# EAGLE design teensyv (EAGLE 9.6.1)
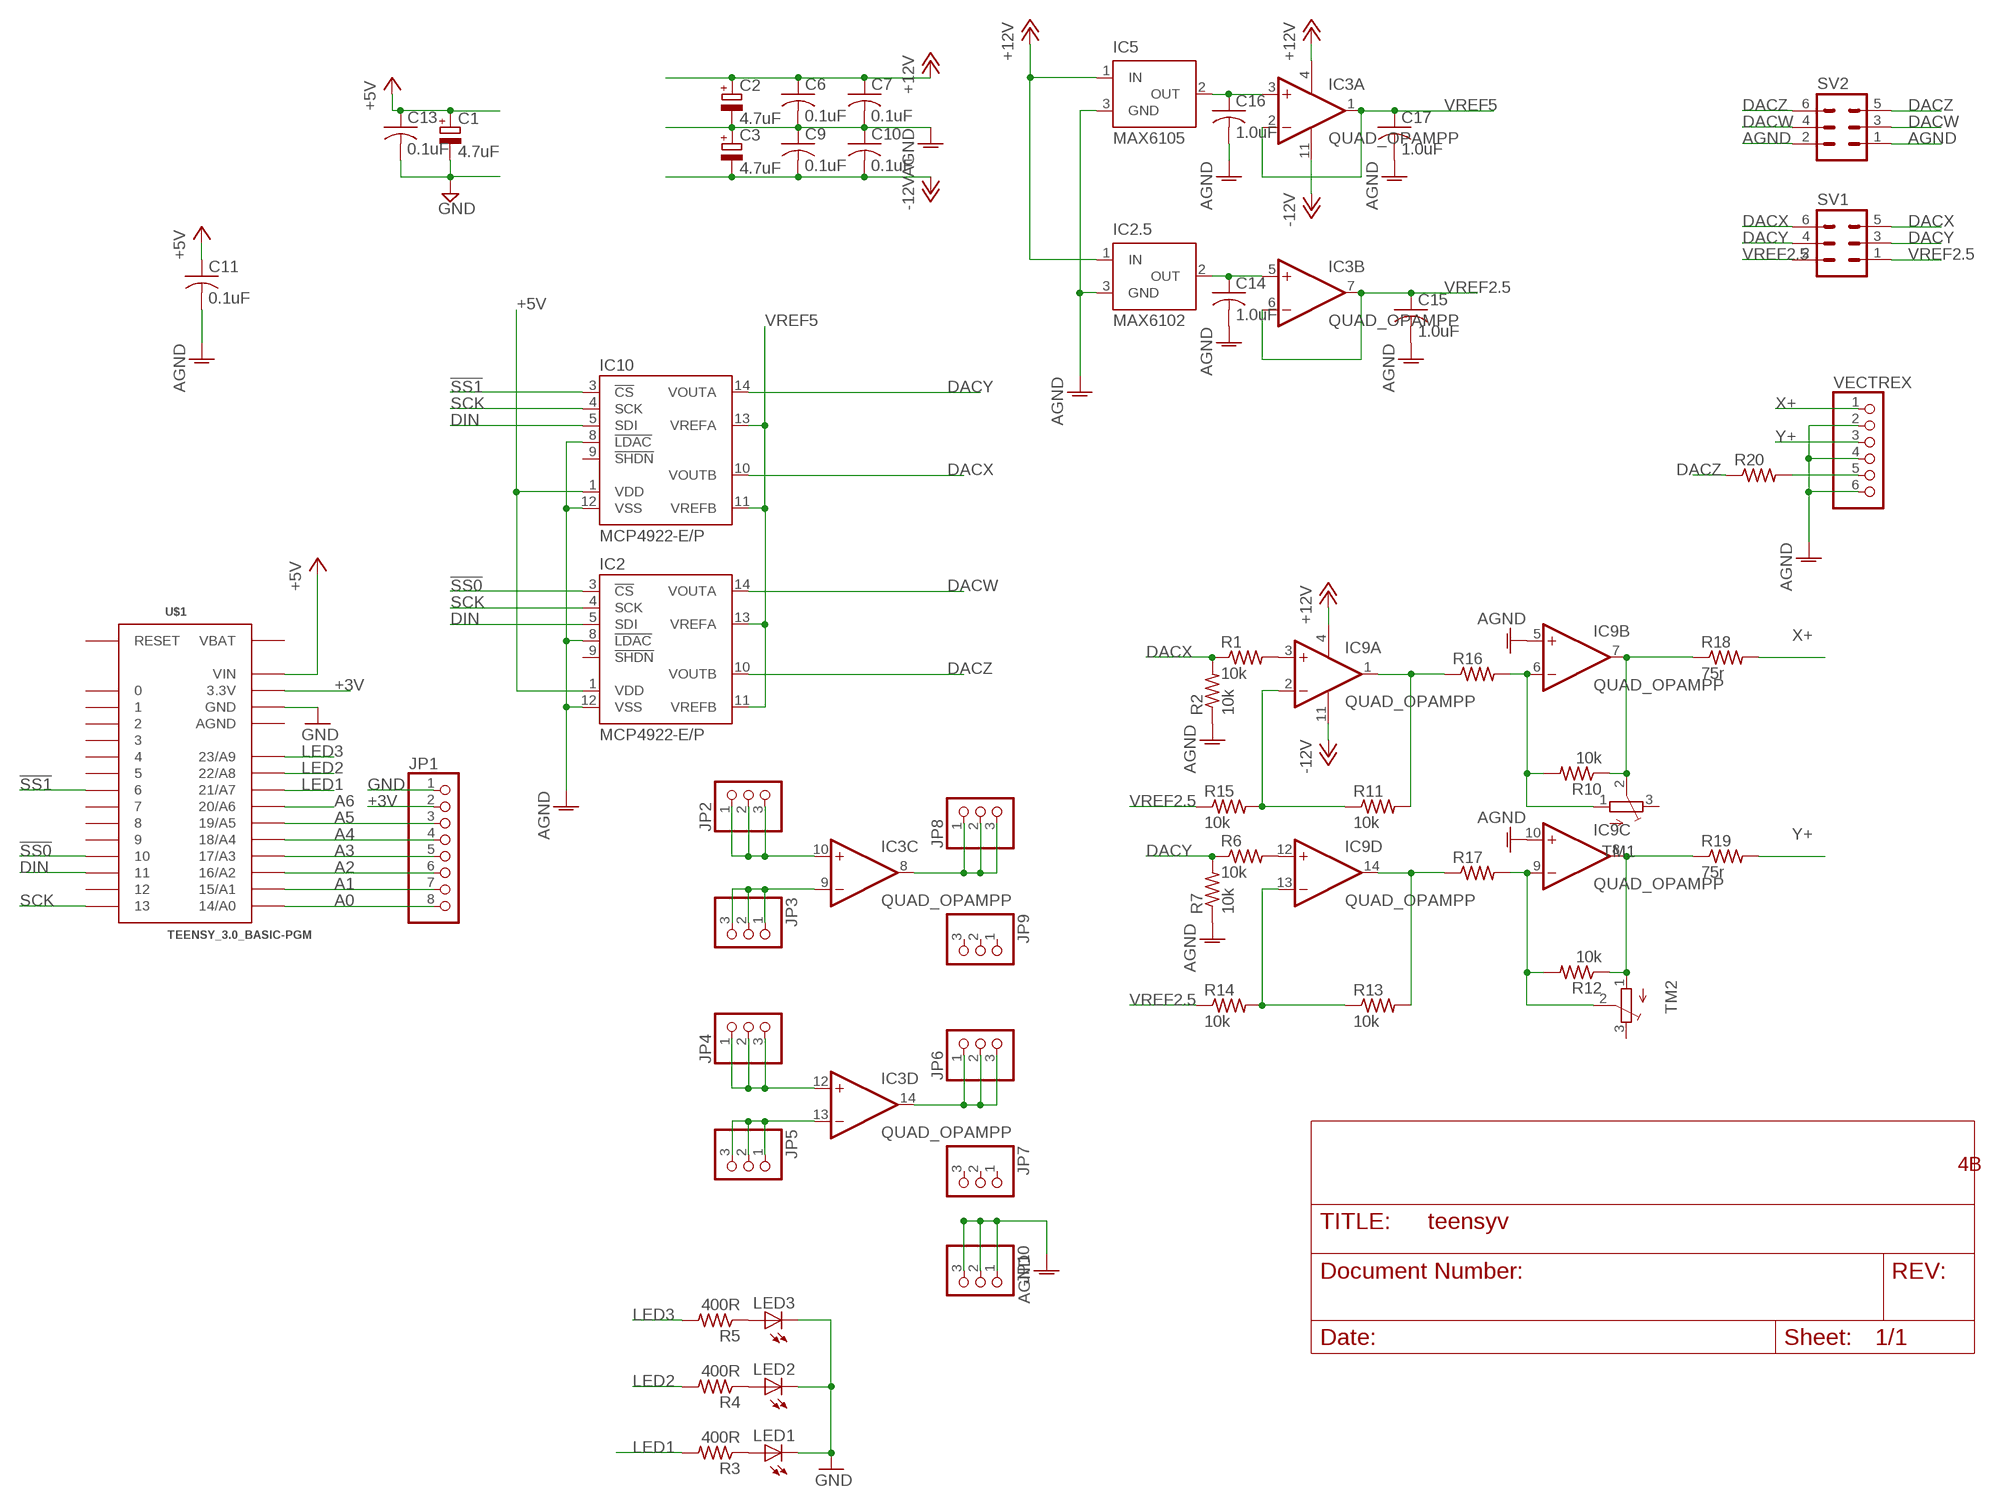
[diagram p0: schematic, sheet 1]

## Parts
C1  4.7uF  CPOL-EUE1.8-4  [E1,8-4]
C2  4.7uF  CPOL-EUE1.8-4  [E1,8-4]
C3  4.7uF  CPOL-EUE1.8-4  [E1,8-4]
C6  0.1uF  C-US025-024X044  [C025-024X044]
C7  0.1uF  C-US025-024X044  [C025-024X044]
C9  0.1uF  C-US025-024X044  [C025-024X044]
C10  0.1uF  C-US025-024X044  [C025-024X044]
C11  0.1uF  C-US025-024X044  [C025-024X044]
C13  0.1uF  C-US025-024X044  [C025-024X044]
C14  1.0uF  C-US025-024X044  [C025-024X044]
C15  1.0uF  C-US025-024X044  [C025-024X044]
C16  1.0uF  C-US025-024X044  [C025-024X044]
C17  1.0uF  C-US025-024X044  [C025-024X044]
IC2  MCP4922-E/P  [DIL14]
IC2.5  MAX6102  MAX6520  [SOT23]
IC3  QUAD_OPAMPP  [DIL14]
IC5  MAX6105  MAX6520  [SOT23]
IC9  QUAD_OPAMPP  [DIL14]
IC10  MCP4922-E/P  [DIL14]
JP1  PINHD-1X8CLEANBIG  [1X08-CLEANBIG]
JP2  PINHD-1X3  [1X03]
JP3  PINHD-1X3  [1X03]
JP4  PINHD-1X3  [1X03]
JP5  PINHD-1X3  [1X03]
JP6  PINHD-1X3  [1X03]
JP7  PINHD-1X3  [1X03]
JP8  PINHD-1X3  [1X03]
JP9  PINHD-1X3  [1X03]
JP10  PINHD-1X3  [1X03]
LED1  LED5MM  [LED5MM]
LED2  LED5MM  [LED5MM]
LED3  LED5MM  [LED5MM]
R1  10k  R-US_0204/2V  [0204V]
R2  10k  R-US_0204/2V  [0204V]
R3  400R  R-US_0204/2V  [0204V]
R4  400R  R-US_0204/2V  [0204V]
R5  400R  R-US_0204/2V  [0204V]
R6  10k  R-US_0204/2V  [0204V]
R7  10k  R-US_0204/2V  [0204V]
R10  10k  R-US_0204/2V  [0204V]
R11  10k  R-US_0204/2V  [0204V]
R12  10k  R-US_0204/2V  [0204V]
R13  10k  R-US_0204/2V  [0204V]
R14  10k  R-US_0204/2V  [0204V]
R15  10k  R-US_0204/2V  [0204V]
R16  R-US_0204/7  [0204/7]
R17  R-US_0204/7  [0204/7]
R18  75r  R-US_0204/2V  [0204V]
R19  75r  R-US_0204/2V  [0204V]
R20  R-US_0204/7  [0204/7]
SV1  MA03-2  [MA03-2]
SV2  MA03-2  [MA03-2]
TM1  TRIMPOTTC33X  [TC33X]
TM2  TRIMPOTTC33X  [TC33X]
U$1  TEENSY_3.0_BASIC-PGM  [TEENSY_3.0_BASIC-PGM]
VECTREX  PINHD-1X6  [1X06]

## Nets
!SS0: IC2.3(!CS) U$1.10
!SS1: IC10.3(!CS) U$1.6
+3V: JP1.2 U$1.3.3V U$1.3.3V1(3.3V)
+5V: C1.+ C11.1 C13.1 IC2.1(VDD) IC10.1(VDD) U$1.VIN
+12V: C2.+ C6.1 C7.1 IC2.5.1(IN) IC3.4(P:V+) IC5.1(IN) IC9.4(P:V+)
-12V: C3.- C9.2 C10.2 IC3.11(P:V-) IC9.11(P:V-)
A0: JP1.8 U$1.14/A0
A1: JP1.7 U$1.15/A1
A2: JP1.6 U$1.16/A2
A3: JP1.5 U$1.17/A3
A4: JP1.4 U$1.18/A4
A5: JP1.3 U$1.19/A5
A6: U$1.20/A6
AGND: C2.- C3.+ C6.2 C7.2 C9.1 C10.1 C11.2 C14.2 C15.2 C16.2 C17.2 IC2.5.3(GND) IC2.8(!LDAC) IC2.12(VSS) IC5.3(GND) IC9.5(B:+IN) IC9.10(C:+IN) IC10.8(!LDAC) IC10.12(VSS) JP10.1 JP10.2 JP10.3 R2.1 R7.1 SV2.1 SV2.2 VECTREX.2 VECTREX.4 VECTREX.6
DACW: IC2.14(VOUTA) SV2.3 SV2.4
DACX: IC10.10(VOUTB) R1.1 R2.2 SV1.5 SV1.6
DACY: IC10.14(VOUTA) R6.1 R7.2 SV1.3 SV1.4
DACZ: IC2.10(VOUTB) R20.1 SV2.5 SV2.6
DIN: IC2.5(SDI) IC10.5(SDI) U$1.11
GND: C1.- C13.2 JP1.1 LED1.K(C) LED2.K(C) LED3.K(C) U$1.GND U$1.GND1(GND)
LED1: R3.2 U$1.21/A7
LED2: R4.2 U$1.22/A8
LED3: R5.2 U$1.23/A9
N$1: C14.1 IC2.5.2(OUT) IC3.5(B:+IN)
N$2: IC9.3(A:+IN) R1.2
N$3: C16.1 IC3.3(A:+IN) IC5.2(OUT)
N$4: IC3.13(D:-IN) JP5.1 JP5.2 JP5.3
N$5: IC3.12(D:+IN) JP4.1 JP4.2 JP4.3
N$6: IC3.14(D:OUT) JP6.1 JP6.2 JP6.3
N$7: LED1.A R3.1
N$8: IC9.1(A:OUT) R11.2 R16.1
N$9: IC9.12(D:+IN) R6.2
N$10: IC9.2(A:-IN) R11.1 R15.2
N$11: LED2.A R4.1
N$12: LED3.A R5.1
N$13: IC9.7(B:OUT) R10.1 R18.1 TM1.2(S)
N$14: IC9.8(C:OUT) R12.1 R19.1 TM2.1(A)
N$15: IC9.14(D:OUT) R13.2 R17.1
N$16: IC9.9(C:-IN) R12.2 R17.2 TM2.2(S)
N$17: IC9.6(B:-IN) R10.2 R16.2 TM1.1(A)
N$18: IC3.9(C:-IN) JP3.1 JP3.2 JP3.3
N$19: IC3.10(C:+IN) JP2.1 JP2.2 JP2.3
N$20: IC3.8(C:OUT) JP8.1 JP8.2 JP8.3
N$23: R20.2 VECTREX.5
SCK: IC2.4(SCK) IC10.4(SCK) U$1.13
VREF2.5: C15.1 IC3.6(B:-IN) IC3.7(B:OUT) R14.1 R15.1 SV1.1 SV1.2
VREF5: C17.1 IC2.11(VREFB) IC2.13(VREFA) IC3.1(A:OUT) IC3.2(A:-IN) IC10.11(VREFB) IC10.13(VREFA)
X+: R18.2 VECTREX.1
Y+: R19.2 VECTREX.3
YFB: IC9.13(D:-IN) R13.1 R14.2
Unconnected: IC2.9(!SHDN) IC10.9(!SHDN) JP7.1 JP7.2 JP7.3 JP9.1 JP9.2 JP9.3 TM1.3(E) TM2.3(E) U$1.0 U$1.1 U$1.2 U$1.3 U$1.4 U$1.5 U$1.7 U$1.8 U$1.9 U$1.12 U$1.RESET

## Notes on the sheet
- 4B

## Power pins joined to a net without a drawn wire
AGND: U$1.AGND
VBAT: U$1.VBAT

## Library data of the parts
C1-C3 = rcl:CPOL-EU: POLARIZED CAPACITOR, European symbol
C6 C7 C9-C11 C13-C17 = adafruit:C-US: CAPACITOR, American symbol
IC2 IC10 = nh-ic:MCP4922: Microchip MCP4922 According to datasheet http://ww1.microchip.com/downloads/en/DeviceDoc/22250A.pdf. Created by Nils Hintze <n.hintze@elektronikpage.net>
IC2.5 IC5 = maxim:MAX6520: 1.2V Voltage Reference 50ppm/°C, SOT23, 3-Terminal Source: http://datasheets.maxim-ic.com/en/ds/MAX6520.pdf
IC3 IC9 = adafruit:QUAD_OPAMP: OP AMP Standard quad package
JP1 = adafruit:PINHD-1X8: PIN HEADER
JP2-JP10 = adafruit:PINHD-1X3: PIN HEADER
LED1-LED3 = adafruit:LED: LED OSRAM: - CHIPLED LG R971, LG N971, LY N971, LG Q971, LY Q971, LO R971, LY R971 LH N974, LH R974 LS Q976, LO Q976, LY Q976 LO Q996 - Hyper CHIPLED LW Q18S LB Q993, LB Q99A, LB R99A - SideLED LS A670, LO A670, LY A670, LG A670, LP A670 LB A673, LV A673, LT A673, LW A673 LH A674 LY A675 LS A676, LA A676, LO A676, LY A676, LW A676 LS A679, LY A679, LG A679 - Hyper Micro SIDELED® LS Y876, LA Y876, LO Y876, LY Y876 LT Y87S - SmartLED LW L88C, LW L88S LB L89C, LB L89S, LG L890 LS L89K, LO L89K, LY L89K LS L896, LA L896, LO L896, LY L896 - TOPLED LS T670, LO T670, LY T670, LG T670, LP T670 LSG T670, LSP T670, LSY T670, LOP T670, LYG T670 LG T671, LOG T671, LSG T671 LB T673, LV T673, LT T673, LW T673 LH T674 LS T676, LA T676, LO T676, LY T676, LB T676, LH T676, LSB T676, LW T676 LB T67C, LV T67C, LT T67C, LS T67K, LO T67K, LY T67K, LW E67C LS E67B, LA E67B, LO E67B, LY E67B, LB E67C, LV E67C, LT E67C LW T67C LS T679, LY T679, LG T679 LS T770, LO T770, LY T770, LG T770, LP T770 LB T773, LV T773, LT T773, LW T773 LH T774 LS E675, LA E675, LY E675, LS T675 LS T776, LA T776, LO T776, LY T776, LB T776 LHGB T686 LT T68C, LB T68C - Hyper Mini TOPLED® LB M676 - Mini TOPLED Santana® LG M470 LS M47K, LO M47K, LY M47K Source: http://www.osram.convergy.de/
R1-R7 R10-R20 = adafruit:R-US_: RESISTOR, American symbol
SV1 SV2 = con-lstb:MA03-2: PIN HEADER; OC_FARNELL: unknown; OC_NEWARK: unknown
TM1 TM2 = adafruit:TRIMPOT: SMT trimmer potentiometer part number TC33X http://www.ladyada.net/library/eagle
U$1 = Teensy3.0 2:TEENSY_3.0_BASIC-PGM: Teensy 3.0 Board outline identical to other 'basic' version except that 'PGM' pin has been omitted. See '+4', 'AllAnalogPins", and 'AllPins' packages for additional pin holes, as needed.
VECTREX = adafruit:PINHD-1X6: PIN HEADER

## Board
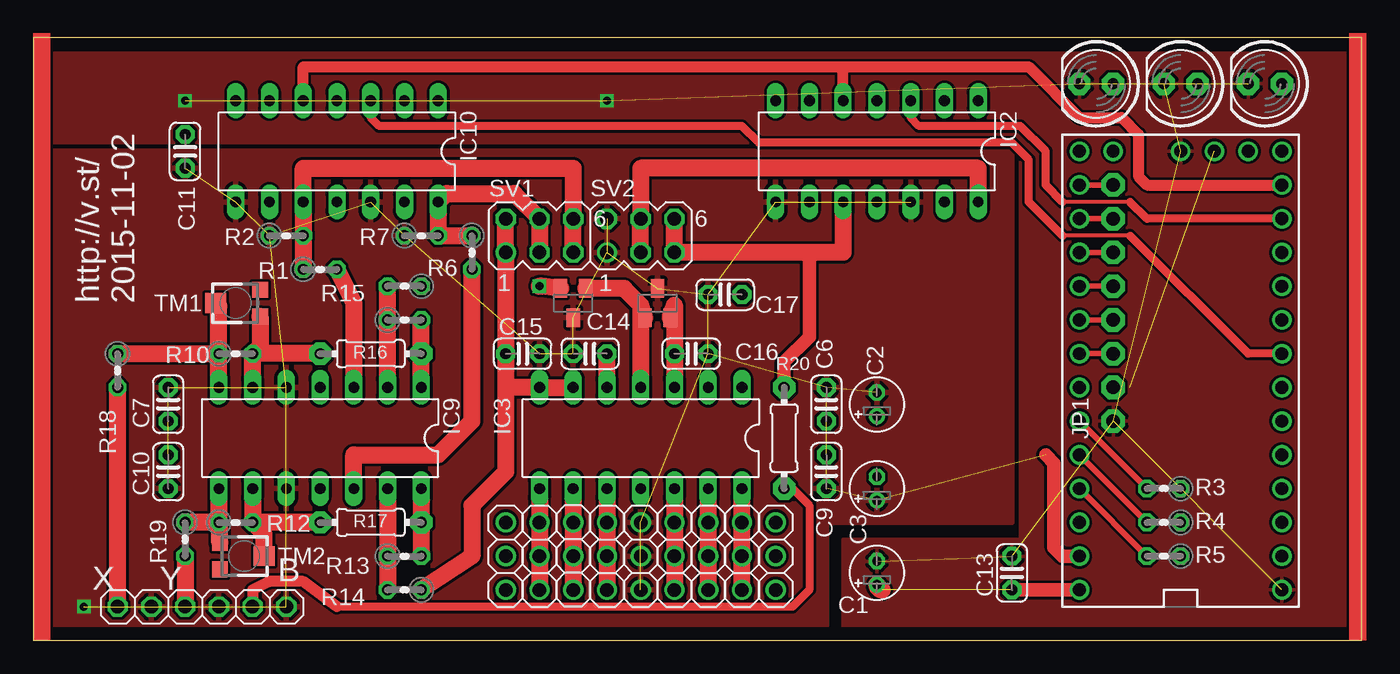
[diagram p1: board, top side]
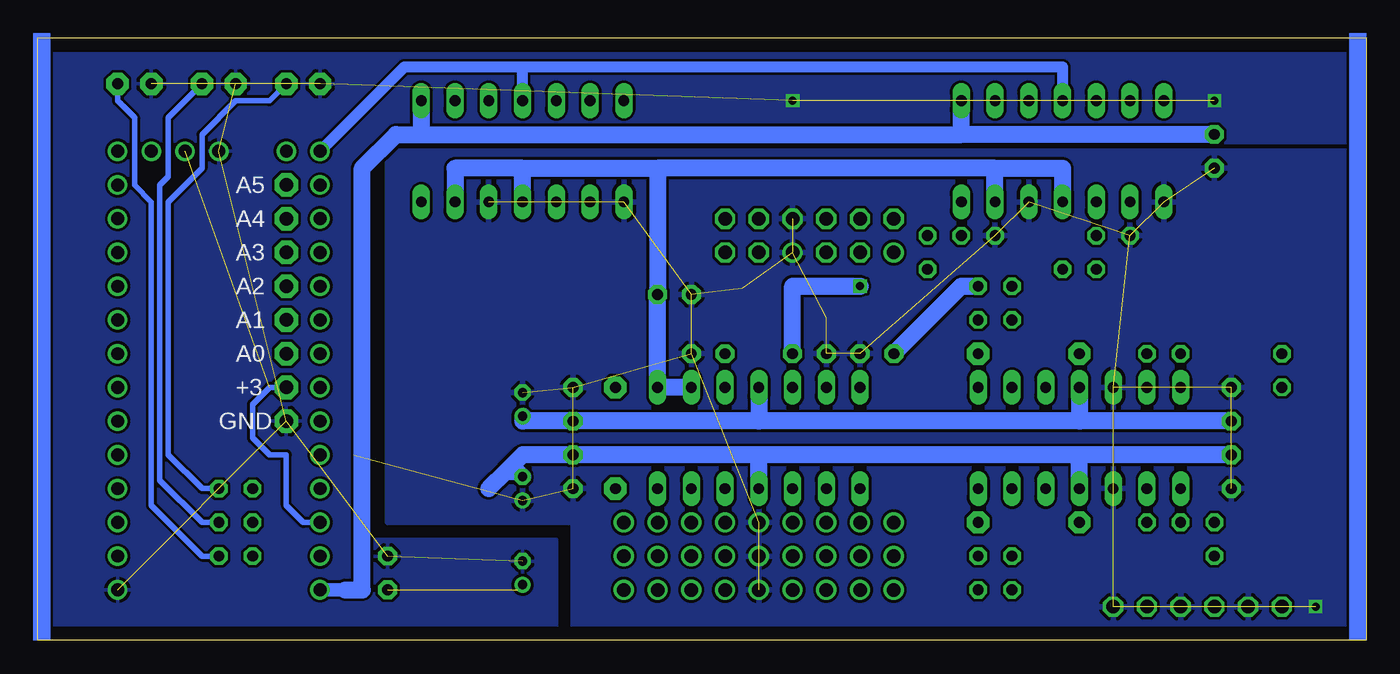
[diagram p2: board, bottom side, seen from below]

Size 100 x 45.39 mm. Coordinates in mm from the lower left corner, seen from the top.
Outline: 0,0 100,0 100,45.39 0,45.39 0,0
Copper layers (1*16): Top 0.035mm / dielectric 1.5mm / Bottom 0.035mm
Design rules "default": minimum track width 10mil, minimum drill 24mil, track to track 8mil, track to pad 8mil, pad to pad 8mil, via to via 8mil, smd to smd 8mil, copper to edge 40mil, drill to drill 8mil, minimum pad ring 10mil, minimum via ring 8mil, stop-mask expansion 4mil, vias tented up to drill 0mil, thermal gap 10mil

### Footprints (pad centres in the part's own frame; a part is rotated, then mirrored left to right if it is on the bottom)
E1,8-4 = drill 0.711 pad 1.168: + -0.889,0 | drill 0.711 pad 1.168 octagon: - 0.889,0
C025-024X044 = drill 0.813 pad 1.422 octagon: 1 -1.27,0; 2 1.27,0
DIL14 = drill 0.813 long: 1 -7.62,-3.81; 2 -5.08,-3.81; 3 -2.54,-3.81; 4 0,-3.81; 5 2.54,-3.81; 6 5.08,-3.81; 7 7.62,-3.81; 8 7.62,3.81; 9 5.08,3.81; 10 2.54,3.81; 11 0,3.81; 12 -2.54,3.81; 13 -5.08,3.81; 14 -7.62,3.81
SOT23 = smd 1 x 1.4: 1 -0.95,-1.1; 2 0.95,-1.1; 3 0,1.1
1X08-CLEANBIG = drill 1.016 pad 1.778 octagon: 1 -8.89,0; 2 -6.35,0; 3 -3.81,0; 4 -1.27,0; 5 1.27,0; 6 3.81,0; 7 6.35,0; 8 8.89,0
1X03 = drill 1.016: 1 -2.54,0; 2 0,0; 3 2.54,0
LED5MM = drill 0.813 pad 1.676 octagon: A -1.27,0; K 1.27,0
0204V = drill 0.813 octagon: 1 -1.27,0; 2 1.27,0
0204/7 = drill 0.813 pad 1.676 octagon: 1 -3.81,0; 2 3.81,0
MA03-2 = drill 1.016: 1 -2.54,-1.27 | drill 1.016 octagon: 2 -2.54,1.27; 3 0,-1.27; 4 0,1.27; 5 2.54,-1.27; 6 2.54,1.27
TC33X = smd 1.2 x 1.2: 1 -1,-1.825; 3 1,-1.825 | smd 1.5 x 1.6: 2 0,1.5
TEENSY_3.0_BASIC-PGM = drill 0.965: 0 -7.62,13.97; 1 -7.62,11.43; 2 -7.62,8.89; 3 -7.62,6.35; 3.3V 7.62,11.43; 3.3V1 -2.54,-16.51; 4 -7.62,3.81; 5 -7.62,1.27; 6 -7.62,-1.27; 7 -7.62,-3.81; 8 -7.62,-6.35; 9 -7.62,-8.89; 10 -7.62,-11.43; 11 -7.62,-13.97; 12 -7.62,-16.51; 13 7.62,-16.51; 14/A0 7.62,-13.97; 15/A1 7.62,-11.43; 16/A2 7.62,-8.89; 17/A3 7.62,-6.35; 18/A4 7.62,-3.81; 19/A5 7.62,-1.27; 20/A6 7.62,1.27; 21/A7 7.62,3.81; 22/A8 7.62,6.35; 23/A9 7.62,8.89; AGND 7.62,13.97; GND -7.62,16.51; GND1 0,-16.51; RESET 5.08,-16.51; VBAT -5.08,-16.51; VIN 7.62,16.51
1X06 = drill 1.016 octagon: 1 -6.35,0; 2 -3.81,0; 3 -1.27,0; 4 1.27,0; 5 3.81,0; 6 6.35,0

### Placement (x,y rotation side)
C1  63.5,5.08 90 top
C2  63.5,17.78 90 top
C3  63.5,11.43 90 top
C6  59.69,17.78 90 top
C7  10.16,17.78 90 top
C9  59.69,12.7 90 top
C10  10.16,12.7 90 top
C11  11.43,36.83 270 top
C13  73.66,5.08 90 top
C14  41.91,21.59 180 top
C15  36.83,21.59 0 top
C16  49.53,21.59 0 top
C17  52.07,26.04 180 top
IC2  63.5,36.83 180 top
IC2.5  40.64,25.4 180 top
IC3  45.72,15.24 180 top
IC5  46.99,25.4 0 top
IC9  21.59,15.24 180 top
IC10  22.86,36.83 180 top
JP1  81.28,25.4 90 top
JP2  43.18,6.35 90 top
JP3  40.64,6.35 270 top
JP4  48.26,6.35 90 top
JP5  50.8,6.35 90 top
JP6  53.34,6.35 90 top
JP7  55.88,6.35 90 top
JP8  38.1,6.35 90 top
JP9  35.56,6.35 90 top
JP10  45.72,6.35 90 top
LED1  80.01,41.91 180 top
LED2  86.36,41.91 180 top
LED3  92.71,41.91 180 top
R1  21.59,27.94 0 top
R2  19.05,30.48 0 top
R3  85.09,11.43 180 top
R4  85.09,8.89 180 top
R5  85.09,6.35 180 top
R6  33.02,29.21 270 top
R7  29.21,30.48 0 top
R10  15.24,21.59 0 top
R11  27.94,24.13 0 top
R12  15.24,8.89 0 top
R13  27.94,6.35 0 top
R14  27.94,3.81 180 top
R15  27.94,26.67 180 top
R16  25.4,21.59 180 top
R17  25.4,8.89 180 top
R18  6.35,20.32 270 top
R19  11.43,7.62 270 top
R20  56.52,15.24 270 top
SV1  38.1,30.48 0 top
SV2  45.72,30.48 0 top
TM1  15.24,25.4 90 top
TM2  15.88,6.35 270 top
U$1  86.36,20.32 180 top
VECTREX  12.7,2.54 0 top

### Tracks (layer width: path | path; a pad name or v marks a point on that pad's centre or on a via)
!SS0
  Top 0.305: 82.55,33.02 77.47,33.02
  Top 0.61: U$1.10 83.82,31.75 82.55,33.02 | 77.47,33.02 76.2,34.29 76.2,36.83 74.3,38.73 66.67,38.73 66.04,39.37 IC2.3
!SS1
  Top 0.305: 82.55,30.48 77.47,30.48
  Top 0.61: U$1.6 91.44,21.59 82.55,30.48 | 77.47,30.48 74.93,33.02 74.93,36.2 73.66,37.47 54.61,37.47 53.34,38.73 26.04,38.73 25.4,39.37 IC10.3
+3V  (1 unrouted)
  Bottom 0.406: U$1.3.3V 80.01,8.89 81.28,10.16 81.28,13.97 82.55,13.97 83.82,15.24 83.82,17.78 82.55,19.05 JP1.2
+5V  (1 unrouted)
  Top 1.016: C13.1 U$1.VIN
  Top 1.27: 63.88,3.81 arc-90 C1.+
  Bottom 1.016: 76.83,3.81 U$1.VIN
  Bottom 1.27: IC2.1 71.12,38.1 | 71.12,38.1 30.48,38.1 | 30.48,38.1 IC10.1 | C11.1 30.48,38.1 | 76.83,3.81 75.56,3.81 75.56,35.56 73.03,38.1 71.12,38.1
+12V
  Top 1.27: IC5.1 45.72,25.25 | 45.72,25.25 IC3.4 | 45.72,25.25 44.47,26.5 IC2.5.1
  Bottom 1.27: C7.1 21.59,16.51 | 21.59,16.51 45.72,16.51 | 45.72,16.51 C6.1 63.5,16.51 C2.+ | IC3.4 45.72,16.51 | IC9.4 21.59,16.51
-12V
  Bottom 1.27: C10.2 21.59,13.97 | 21.59,13.97 45.72,13.97 | 45.72,13.97 C9.2 63.5,13.97 64.77,12.7 | IC3.11 45.72,13.97 | IC9.11 21.59,13.97 | 64.77,12.7 66.04,11.43 | C3.- 63.88,12.7 64.77,12.7
A0
  Top 0.406: U$1.14/A0 JP1.8
A1
  Top 0.406: U$1.15/A1 JP1.7
A2
  Top 0.406: U$1.16/A2 JP1.6
A3
  Top 0.406: U$1.17/A3 JP1.5
A4
  Top 0.406: U$1.18/A4 JP1.4
A5
  Top 0.406: U$1.19/A5 JP1.3
AGND  (via drill 0.6)  (30 unrouted)
  Top 1.016: U$1.AGND 77.47,6.35 76.83,6.99 76.83,13.34 76.2,13.97
  other vias: 3.81,2.54
  pour Bottom: 1.27,36.83 73.66,36.83 73.66,8.89 59.69,8.89 59.69,0 1.27,0
  pour Top: 1.27,36.83 73.66,36.83 73.66,8.89 59.69,8.89 59.69,0 1.27,0
DACW
  Top 1.27: SV2.3 SV2.4 45.72,35.56 71.12,35.56 IC2.14
DACX
  Top 1.27: R1.1 R2.2 IC10.10 20.32,35.56 40.64,35.56 SV1.6 SV1.5
DACY
  Top 1.27: R6.1 R7.2 IC10.14 31.11,33.66 36.2,33.66 SV1.4 SV1.3
DACZ
  Top 1.016: R20.1 56.52,20.95 58.42,22.86 58.42,29.21
  Top 1.27: SV2.6 SV2.5 58.42,29.21 60.96,29.21 IC2.10
DIN
  Top 0.813: IC10.5 20.32,43.18 60.96,43.18 | IC2.5 60.96,43.18 | 60.96,43.18 74.93,43.18 78.74,39.37 81.92,39.37 83.19,38.1 83.19,34.92 83.82,34.29 U$1.11
GND  (via drill 0.6)  (9 unrouted)
  other vias: 11.43,40.64 43.18,40.64
  pour Bottom: 1.27,44.45 99.06,44.45 99.06,-1.27 60.96,-1.27 60.96,7.62 74.93,7.62 74.93,37.47 1.27,37.47
  pour Top: 1.27,44.45 99.06,44.45 99.06,-1.27 60.96,-1.27 60.96,7.62 74.3,7.62 74.3,37.47 1.27,37.47
LED1
  Top 0.406: U$1.21/A7 R3.2
LED2
  Top 0.406: U$1.22/A8 R4.2
LED3
  Top 0.406: U$1.23/A9 R5.2
N$1  (via drill 0.6)
  Top 1.27: IC3.5 C14.1 | IC2.5.2 38.25,26.67 v38.1,26.67
  Bottom 1.27: C14.1 43.18,26.67 v38.1,26.67
N$2
  Top 1.27: R1.2 24.13,25.4 IC9.3
N$3
  Top 1.27: IC5.2 48.26,25.25 C16.1 IC3.3
N$4
  Top 1.27: IC3.13 JP5.3 JP5.2 JP5.1
N$5
  Top 1.27: IC3.12 JP4.3 JP4.2 JP4.1
N$6
  Top 1.27: JP6.1 JP6.2 JP6.3 IC3.14
N$7
  Bottom 0.406: LED1.A 82.55,40.64 85.09,40.64 87.63,38.1 87.63,35.56 90.17,33.02 90.17,13.97 87.63,11.43 R3.1
N$8
  Top 1.27: IC9.1 R16.1 R11.2
N$9
  Top 1.27: IC9.12 24.13,13.97 30.48,13.97 33.02,16.51 R6.2
N$10
  Top 1.27: IC9.2 R11.1 R15.2
N$11
  Bottom 0.406: R4.1 87.63,8.89 90.81,12.06 90.81,34.29 90.17,34.92 90.17,39.37 LED2.A
N$12
  Bottom 0.406: LED3.A 93.98,40.64 92.71,39.37 92.71,34.29 91.44,33.02 91.44,10.16 87.63,6.35 R5.1
N$13
  Top 1.27: IC9.7 R10.1 | R18.1 R10.1 | R10.1 13.97,25.17 TM1.2
N$14
  Top 1.27: IC9.8 R12.1 | R12.1 R19.1 | TM2.1 14.05,8.81 R12.1
N$15
  Top 1.27: IC9.14 R17.1 R13.2
N$16
  Top 1.27: IC9.9 R12.2 | R17.2 R12.2 | TM2.2 17.38,8.03 R12.2
N$17
  Top 1.27: IC9.6 R10.2 | TM1.1 17.07,22.14 R10.2 | R16.2 R10.2
N$18
  Top 1.27: IC3.9 JP3.1 JP3.2 JP3.3
N$19
  Top 1.27: IC3.10 JP2.3 JP2.2 JP2.1
N$20
  Top 1.27: IC3.8 JP8.3 JP8.2 JP8.1
N$23
  Top 0.61: R20.2 57.15,11.43 58.42,10.16 58.42,3.81 57.15,2.54 22.86,2.54
  Top 0.813: 22.86,2.54 20.32,4.45 17.78,4.45 16.51,3.81 VECTREX.5
SCK
  Bottom 0.813: U$1.13 72.39,43.18 63.5,43.18 | 63.5,43.18 22.86,43.18 IC10.4 | IC2.4 63.5,43.18
VREF2.5
  Top 1.27: 35.56,19.05 C15.1 SV1.1 SV1.2 | 35.56,19.05 35.56,12.7 33.02,10.16 33.02,6.35 R14.1 | IC3.6 IC3.7 35.56,19.05
  Bottom 1.27: C15.1 30.48,26.67 R15.1
VREF5
  Bottom 1.27: 63.5,35.56 53.34,35.56 | 27.94,35.56 22.86,35.56 IC10.11 | IC10.13 27.94,35.56 | 63.5,35.56 68.58,35.56 IC2.13 | IC2.11 63.5,35.56 | IC3.2 IC3.1 C17.1 53.34,35.56 | 27.94,35.56 53.34,35.56
X+
  Top 1.27: VECTREX.1 R18.2
Y+
  Top 1.27: R19.2 VECTREX.3
YFB
  Top 1.27: IC9.13 R13.1 R14.2
(copper drawn outside any net)
  shapes: Bottom area x2, Top area x2

### Text on the board
tNames: http://v.st/ / 2015-11-02 | X | Y | B
bNames: A5 | A4 | A3 | A2 | A1 | A0 | +3 | GND